# Altium schematic sheet Revision_History.SchDoc: Revision History
size A4; Author: J. Garnier; DrawnBy: J. Garnier; SheetNumber: 2; SheetTotal: 2
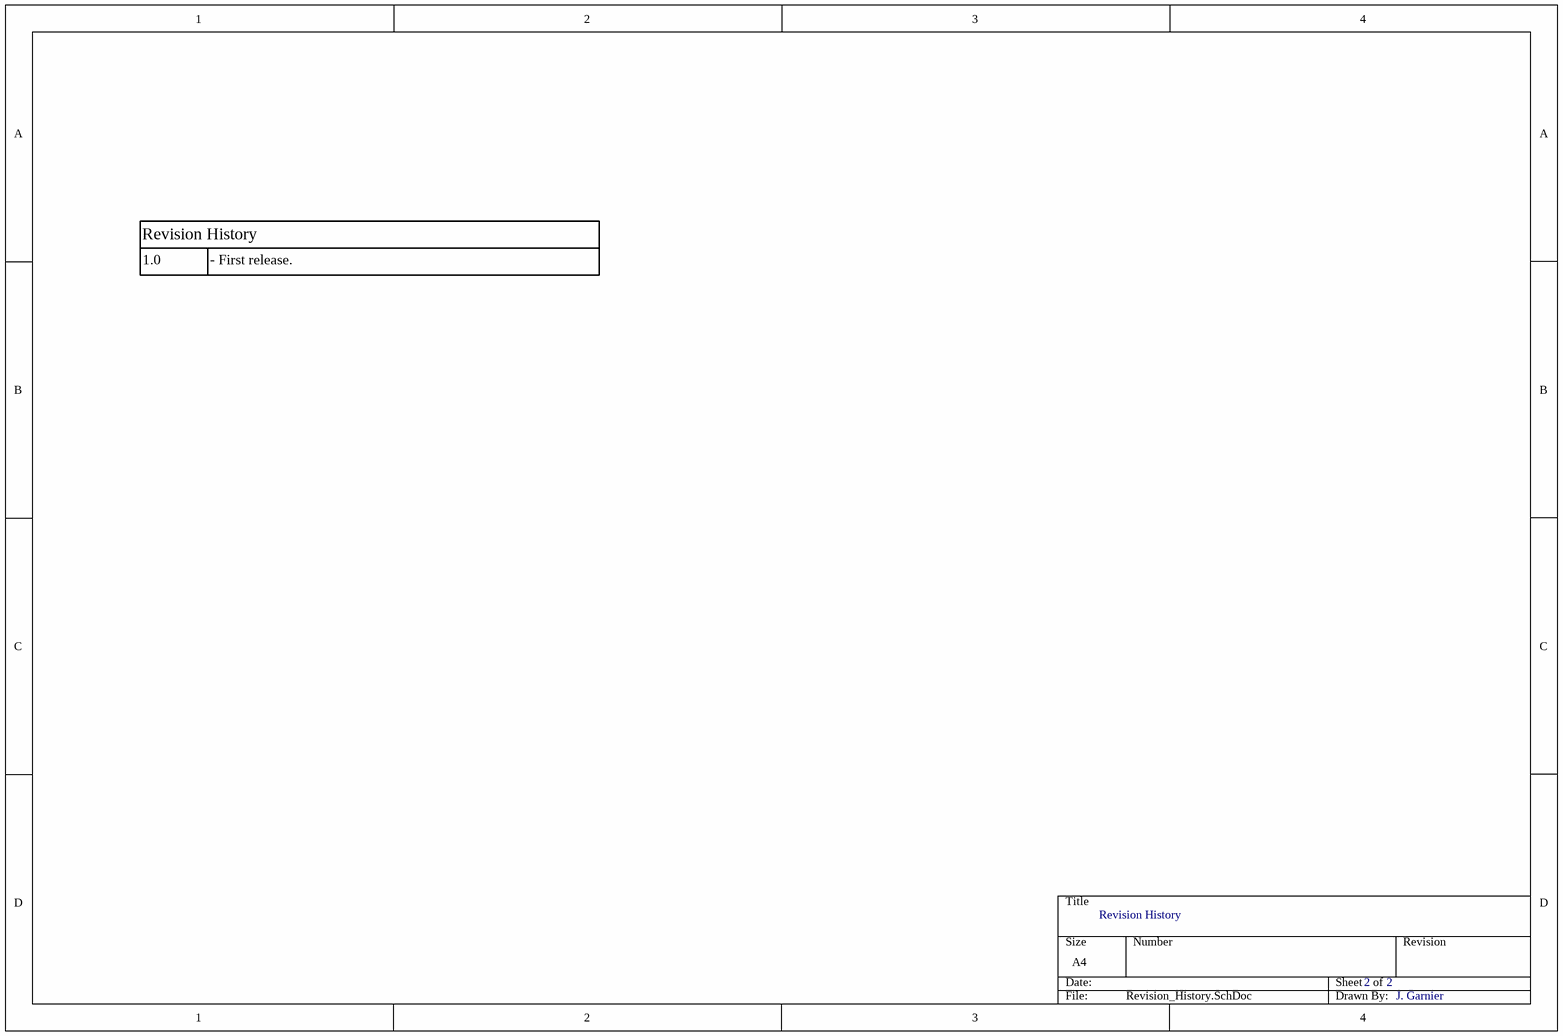
[diagram p0: Revision_History.SchDoc]

## Notes on the sheet
- Revision History
- 1.0
- - First release.
- Drawn:
- Morse Micro
- Title
- Level 8, 10-14 Waterloo Street
- Surry Hills, NSW 2010
- AUSTRALIA
- (c) Copyright 2024
- Checked:
- Approved:
- Date Released:
- Drawing No:
- PCBA No:
- Drawing
- Revision:
- Size:
- A4
- File:
- Sheet
- of